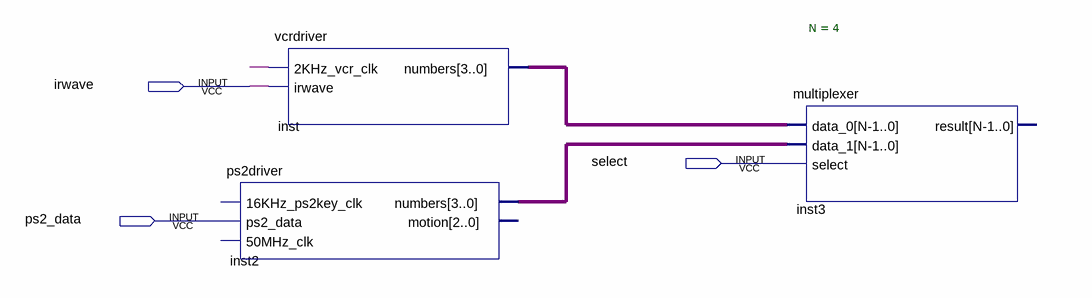
[diagram p0: schematic sheet]
// Quartus schematic top_level.bdf as structural Verilog: 3 symbols, 3 pins
module top_level (
  input  irwave,
  input  select,
  input  ps2_data
);

  wire undriven;
  wire [3:0] inst2_numbers, inst_numbers;

  ps2driver inst2 (.ps2_data(ps2_data), .numbers(inst2_numbers));  // open: 16KHz_ps2key_clk, 50MHz_clk, motion
  vcrdriver inst (.\2KHz_vcr_clk (undriven), .irwave(irwave), .numbers(inst_numbers));
  multiplexer #(.N(4)) inst3 (.data_0(inst_numbers), .data_1(inst2_numbers), .select(select));  // open: result
endmodule
